# Altium schematic sheet USB_Connectors.SchDoc: Apalis Evaluation Board 1.1
size A3; Organization: Toradex AG; Address1: Altsagenstrasse 5; Address2: Horw; Address3: 6048; Address4: Switzerland; DocumentNumber: 7; Revision: V1.1; SheetNumber: 7; SheetTotal: 32; PageSetup: Record=PageOptions|CenterHorizontal=True|CenterVertical=True|PrintScale=0.71|XCorrection=1.00|YCorrection=1.00|PrintKind=0|BorderSize=5000000|LeftOffset=0|BottomOffset=0|Orientation=2|PaperLength=1000|PaperWidth=1000|Scale=100|PaperSource=7|PrintQuality=-4|MediaType=1|DitherType=10|PaperKind=A4|PrintScaleMode=1
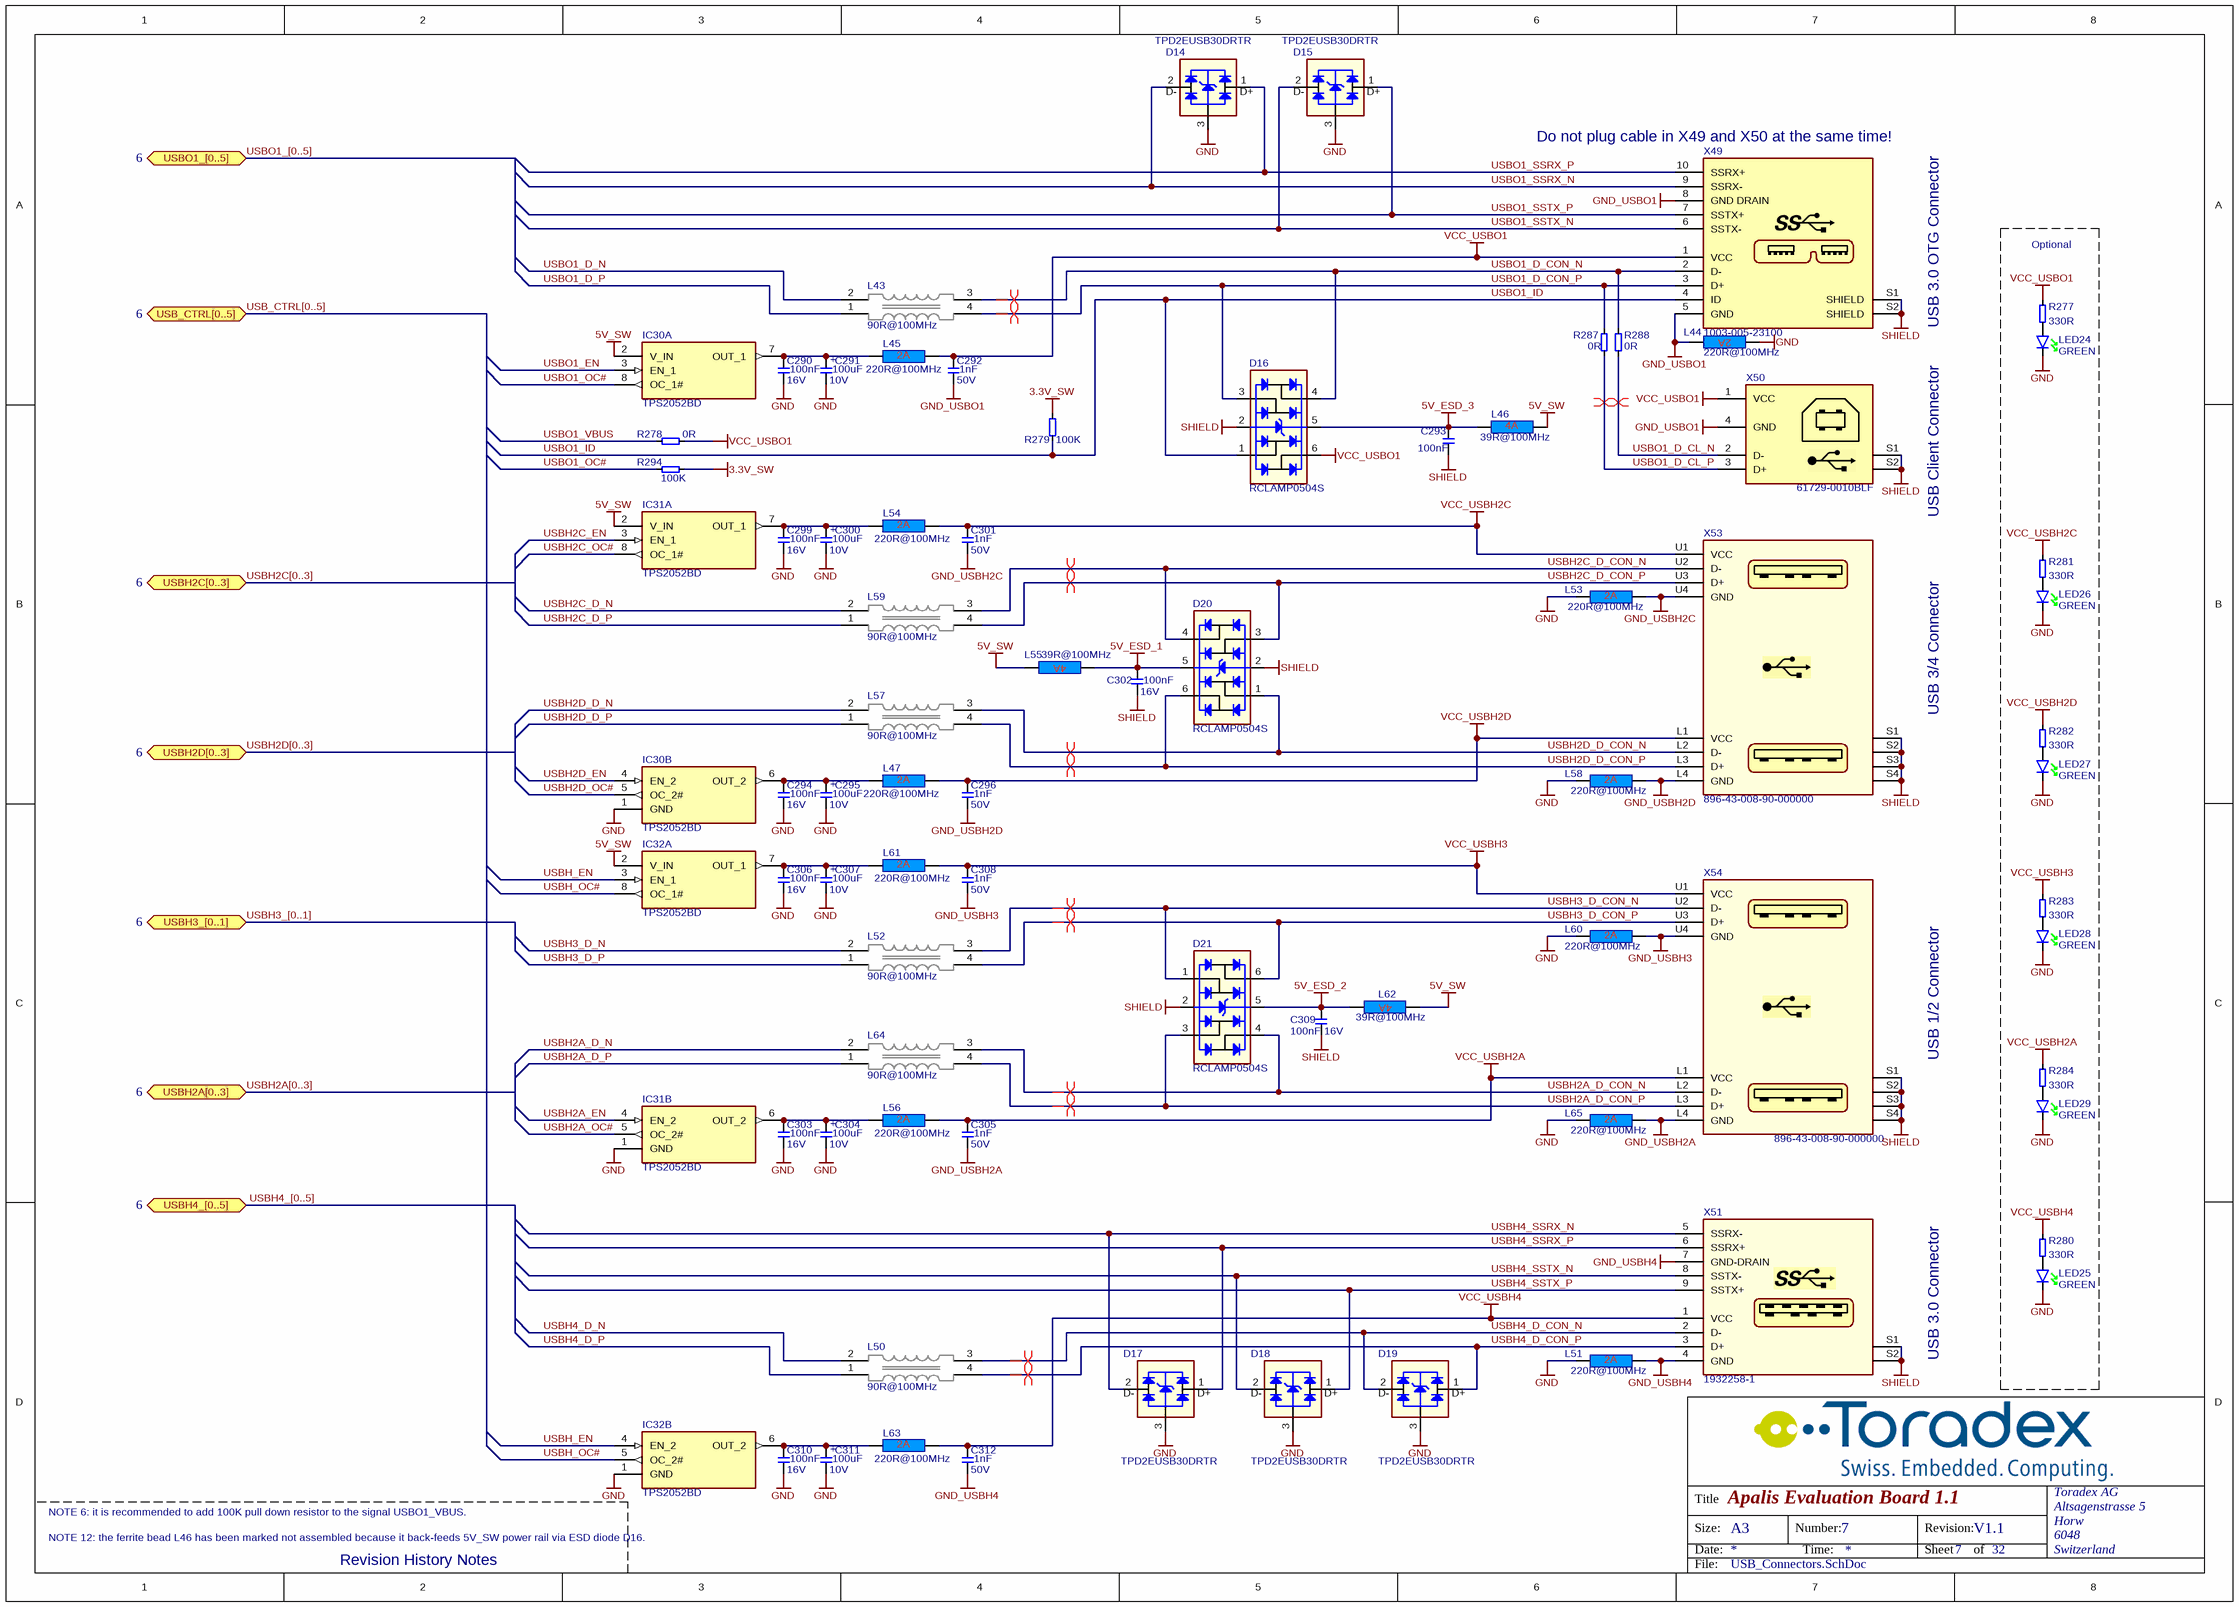
[diagram p0: USB_Connectors.SchDoc]

## Parts
C290  Rating: 16V  [T_CAPC0603X33N]  (hidden comment: 100nF)
C291  Rating: 10V  [CAPMP6032X280N]  (hidden comment: 100uF)
C292  Rating: 50V  [T_CAPC0603X33N]  (hidden comment: 1nF)
C293  100nF  [T_CAPC0603X33N]
C294  Rating: 16V  [T_CAPC0603X33N]  (hidden comment: 100nF)
C295  Rating: 10V  [CAPMP6032X280N]  (hidden comment: 100uF)
C296  Rating: 50V  [T_CAPC0603X33N]  (hidden comment: 1nF)
C299  Rating: 16V  [T_CAPC0603X33N]  (hidden comment: 100nF)
C300  Rating: 10V  [CAPMP6032X280N]  (hidden comment: 100uF)
C301  Rating: 50V  [T_CAPC0603X33N]  (hidden comment: 1nF)
C302  Rating: 16V  [T_CAPC0603X33N]  (hidden comment: 100nF)
C303  Rating: 16V  [T_CAPC0603X33N]  (hidden comment: 100nF)
C304  Rating: 10V  [CAPMP6032X280N]  (hidden comment: 100uF)
C305  Rating: 50V  [T_CAPC0603X33N]  (hidden comment: 1nF)
C306  Rating: 16V  [T_CAPC0603X33N]  (hidden comment: 100nF)
C307  Rating: 10V  [CAPMP6032X280N]  (hidden comment: 100uF)
C308  Rating: 50V  [T_CAPC0603X33N]  (hidden comment: 1nF)
C309  Rating: 16V  [T_CAPC0603X33N]  (hidden comment: 100nF)
C310  Rating: 16V  [T_CAPC0603X33N]  (hidden comment: 100nF)
C311  Rating: 10V  [CAPMP6032X280N]  (hidden comment: 100uF)
C312  Rating: 50V  [T_CAPC0603X33N]  (hidden comment: 1nF)
D14  TPD2EUSB30DRTR  [T_TI_TPD2EUSB30DRTR]
D15  TPD2EUSB30DRTR  [T_TI_TPD2EUSB30DRTR]
D16  RCLAMP0504S  [T_SOT95P285X90-6N]
D17  TPD2EUSB30DRTR  [T_TI_TPD2EUSB30DRTR]
D18  TPD2EUSB30DRTR  [T_TI_TPD2EUSB30DRTR]
D19  TPD2EUSB30DRTR  [T_TI_TPD2EUSB30DRTR]
D20  RCLAMP0504S  [T_SOT95P285X90-6N]
D21  RCLAMP0504S  [T_SOT95P285X90-6N]
IC30  TPS2052BD  [SOIC127P600X173-8N]  (parts A,B of 2)
IC31  TPS2052BD  [SOIC127P600X173-8N]  (parts A,B of 2)
IC32  TPS2052BD  [SOIC127P600X173-8N]  (parts A,B of 2)
L43  90R@100MHz  [T_Murata_DLW21SN900SQ2]
L44  220R@100MHz  [INDC1608X95N]
L45  220R@100MHz  [INDC1608X95N]
L46  39R@100MHz  [INDC2013X130N]
L47  220R@100MHz  [INDC1608X95N]
L50  90R@100MHz  [T_Murata_DLW21SN900SQ2]
L51  220R@100MHz  [INDC1608X95N]
L52  90R@100MHz  [T_Murata_DLW21SN900SQ2]
L53  220R@100MHz  [INDC1608X95N]
L54  220R@100MHz  [INDC1608X95N]
L55  39R@100MHz  [INDC2013X130N]
L56  220R@100MHz  [INDC1608X95N]
L57  90R@100MHz  [T_Murata_DLW21SN900SQ2]
L58  220R@100MHz  [INDC1608X95N]
L59  90R@100MHz  [T_Murata_DLW21SN900SQ2]
L60  220R@100MHz  [INDC1608X95N]
L61  220R@100MHz  [INDC1608X95N]
L62  39R@100MHz  [INDC2013X130N]
L63  220R@100MHz  [INDC1608X95N]
L64  90R@100MHz  [T_Murata_DLW21SN900SQ2]
L65  220R@100MHz  [INDC1608X95N]
LED24  Color: GREEN  [T_Osram_T670_GREEN]  (hidden comment: LG T670-K1L2-1)
LED25  Color: GREEN  [T_Osram_T670_GREEN]  (hidden comment: LG T670-K1L2-1)
LED26  Color: GREEN  [T_Osram_T670_GREEN]  (hidden comment: LG T670-K1L2-1)
LED27  Color: GREEN  [T_Osram_T670_GREEN]  (hidden comment: LG T670-K1L2-1)
LED28  Color: GREEN  [T_Osram_T670_GREEN]  (hidden comment: LG T670-K1L2-1)
LED29  Color: GREEN  [T_Osram_T670_GREEN]  (hidden comment: LG T670-K1L2-1)
R277  330R  [T_RESC0603X30N]
R278  0R  [T_RESC0603X30N]
R279  100K  [t_RESC0603X30N]
R280  330R  [T_RESC0603X30N]
R281  330R  [T_RESC0603X30N]
R282  330R  [T_RESC0603X30N]
R283  330R  [T_RESC0603X30N]
R284  330R  [T_RESC0603X30N]
R287  0R  [RESC1005X40N]
R288  0R  [RESC1005X40N]
R294  100K  [t_RESC0603X30N]
X49  1003-005-23100  [T_Cnc_1003-005-23100]
X50  61729-0010BLF  [T_FCI_61729-0010BLF]
X51  1932258-1  [T_TE_1932258-1]
X53  896-43-008-90-000000  [T_MMMC_896-43-008-90-000000]
X54  896-43-008-90-000000  [T_MMMC_896-43-008-90-000000]

## Blocks framed on the sheet
Optional: LED24-LED29 R277 R280-R284

## Ports
USB_CTRL[0..5] (bidir, see 6), USBH2A[0..3] (bidir, see 6), USBH2C[0..3] (bidir, see 6), USBH2D[0..3] (bidir, see 6), USBH3_[0..1] (bidir, see 6), USBH4_[0..5] (bidir, see 6), USBO1_[0..5] (bidir, see 6)

## Nets
3.3V_SW: R279.1 R294.2
5V_ESD_1: C302.2 D20.5 L55.1
5V_ESD_2: C309.2 D21.5 L62.2
5V_ESD_3: C293.2 D16.5 L46.1
5V_SW: IC30.2(V_IN) IC31.2(V_IN) IC32.2(V_IN) L46.2 L55.2 L62.1
GND: C290.1 C291.2 C294.1 C295.2 C299.1 C300.2 C303.1 C304.2 C306.1 C307.2 C310.1 C311.2 D14.3 D15.3 D17.3 D18.3 D19.3 IC30.1(GND) IC31.1(GND) IC32.1(GND) L44.1 L51.1 L53.1 L58.1 L60.1 L65.1 LED24.K LED25.K LED26.K LED27.K LED28.K LED29.K
GND_USBH2A: C305.1 L65.2 X54.L4(GND)
GND_USBH2C: C301.1 L53.2 X53.U4(GND)
GND_USBH2D: C296.1 L58.2 X53.L4(GND)
GND_USBH3: C308.1 L60.2 X54.U4(GND)
GND_USBH4: C312.1 L51.2 X51.4(GND) X51.7(GND-DRAIN)
GND_USBO1: C292.1 L44.2 X49.5(GND) X49.8(GND_DRAIN) X50.4(GND)
SHIELD: C293.1 C302.1 C309.1 D16.2 D20.2 D21.2 X49.S1(SHIELD) X49.S2(SHIELD) X50.S1 X50.S2 X51.S1(SHIELD) X51.S2(SHIELD) X53.S1(SHIELD) X53.S2(SHIELD) X53.S3(SHIELD) X53.S4(SHIELD) X54.S1(SHIELD) X54.S2(SHIELD) X54.S3(SHIELD) X54.S4(SHIELD)
VCC_USBH2A: C305.2 L56.2 R284.2 X54.L1(VCC)
VCC_USBH2C: C301.2 L54.2 R281.2 X53.U1(VCC)
VCC_USBH2D: C296.2 L47.2 R282.2 X53.L1(VCC)
VCC_USBH3: C308.2 L61.2 R283.2 X54.U1(VCC)
VCC_USBH4: C312.2 L63.2 R280.2 X51.1(VCC)
VCC_USBO1: C292.2 D16.6 L45.2 R277.2 R278.2 X49.1(VCC) X50.1(VCC)
USBH2A_D_CON_N: D21.4 L64.3 X54.L2(D-)
USBH2A_D_CON_P: D21.3 L64.4 X54.L3(D+)
USBH2A_D_N: L64.2
USBH2A_D_P: L64.1
USBH2A_EN: IC31.4(EN_2)
USBH2A_OC#: IC31.5(OC_2#)
USBH2C_D_CON_N: D20.4 L59.3 X53.U2(D-)
USBH2C_D_CON_P: D20.3 L59.4 X53.U3(D+)
USBH2C_D_N: L59.2
USBH2C_D_P: L59.1
USBH2C_EN: IC31.3(EN_1)
USBH2C_OC#: IC31.8(OC_1#)
USBH2D_D_CON_N: D20.1 L57.3 X53.L2(D-)
USBH2D_D_CON_P: D20.6 L57.4 X53.L3(D+)
USBH2D_D_N: L57.2
USBH2D_D_P: L57.1
USBH2D_EN: IC30.4(EN_2)
USBH2D_OC#: IC30.5(OC_2#)
USBH3_D_CON_N: D21.1 L52.3 X54.U2(D-)
USBH3_D_CON_P: D21.6 L52.4 X54.U3(D+)
USBH3_D_N: L52.2
USBH3_D_P: L52.1
USBH4_D_CON_N: D19.2(D-) L50.3 X51.2(D-)
USBH4_D_CON_P: D19.1(D+) L50.4 X51.3(D+)
USBH4_D_N: L50.2
USBH4_D_P: L50.1
USBH4_SSRX_N: D17.2(D-) X51.5(SSRX-)
USBH4_SSRX_P: D17.1(D+) X51.6(SSRX+)
USBH4_SSTX_N: D18.2(D-) X51.8(SSTX-)
USBH4_SSTX_P: D18.1(D+) X51.9(SSTX+)
USBH_EN: IC32.3(EN_1) IC32.4(EN_2)
USBH_OC#: IC32.5(OC_2#) IC32.8(OC_1#)
USBO1_D_CL_N: R288.1 X50.2(D-)
USBO1_D_CL_P: R287.1 X50.3(D+)
USBO1_D_CON_N: D16.4 L43.3 R288.2 X49.2(D-)
USBO1_D_CON_P: D16.3 L43.4 R287.2 X49.3(D+)
USBO1_D_N: L43.2
USBO1_D_P: L43.1
USBO1_EN: IC30.3(EN_1)
USBO1_ID: D16.1 R279.2 X49.4(ID)
USBO1_OC#: IC30.8(OC_1#) R294.1
USBO1_SSRX_N: D14.2(D-) X49.9(SSRX-)
USBO1_SSRX_P: D14.1(D+) X49.10(SSRX+)
USBO1_SSTX_N: D15.2(D-) X49.6(SSTX-)
USBO1_SSTX_P: D15.1(D+) X49.7(SSTX+)
USBO1_VBUS: R278.1
NetC290_2: C290.2 C291.1 IC30.7(OUT_1) L45.1
NetC294_2: C294.2 C295.1 IC30.6(OUT_2) L47.1
NetC299_2: C299.2 C300.1 IC31.7(OUT_1) L54.1
NetC303_2: C303.2 C304.1 IC31.6(OUT_2) L56.1
NetC306_2: C306.2 C307.1 IC32.7(OUT_1) L61.1
NetC310_2: C310.2 C311.1 IC32.6(OUT_2) L63.1
NetLED24_A: LED24.A R277.1
NetLED25_A: LED25.A R280.1
NetLED26_A: LED26.A R281.1
NetLED27_A: LED27.A R282.1
NetLED28_A: LED28.A R283.1
NetLED29_A: LED29.A R284.1

## Buses and harness runs
bus USB_CTRL[0..5] = port USB_CTRL[0..5]
bus USBH2A[0..3] = port USBH2A[0..3]
bus USBH2C[0..3] = port USBH2C[0..3]
bus USBH2D[0..3] = port USBH2D[0..3]
bus USBH3_[0..1] = port USBH3_[0..1]
bus USBH4_[0..5] = port USBH4_[0..5]
bus USBO1_[0..5] = port USBO1_[0..5]

## Layout directives
differential pair: USBH2A_D_CON_N, USBH2A_D_CON_P, USBH2C_D_CON_N, USBH2C_D_CON_P, USBH2D_D_CON_N, USBH2D_D_CON_P, USBH3_D_CON_N, USBH3_D_CON_P, USBH4_D_CON_N, USBH4_D_CON_P, USBO1_D_CL_N, USBO1_D_CL_P, USBO1_D_CON_N, USBO1_D_CON_P

## Notes on the sheet
- (near X49) Do not plug cable in X49 and X50 at the same time!
- (near X49) USB 3.0 OTG Connector
- USB Client Connector
- (near X53) USB 3/4 Connector
- (near X54) USB 1/2 Connector
- (near X51) USB 3.0 Connector
- NOTE 6: it is recommended to add 100K pull down resistor to the signal USBO1_VBUS.
- NOTE 12: the ferrite bead L46 has been marked not assembled because it back-feeds 5V_SW power rail via ESD diode D16.
- Revision History Notes
- Title
- Size:
- Date:
- A3
- Number:
- Time:
- Revision:
- Sheet
- of
- File:
- (in symbol C-TA-100uF-10V-10%-6032) +

## Library data of the parts
C290 C293 C294 C299 C302 C303 C306 C309 C310 = C-X7R-100nF-16V-10%-0603: Capacitor Ceramic X7R 100nF 16V 10% 0603; Tolerance: 10%; Type: X7R; Value: 100nF
C291 C295 C300 C304 C307 C311 = C-TA-100uF-10V-10%-6032: Capacitor TA 100uF 10V 10% 6032; Tolerance: 10%; Type: TA; Value: 100uF
C292 C296 C301 C305 C308 C312 = C-X7R-1nF-50V-10%-0603: Capacitor Ceramic X7R 1nF 50V 10% 0603; Tolerance: 10%; Type: X7R; Value: 1nF
D14 D15 D17-D19 = D-TI-TPD2EUSB30DRTR: 2 Channel Protection for Super Speed USB3.0; Manufacturer Name: TI; Manufacturer Part No.: TPD2EUSB30DRTR
D16 D20 D21 = D-Semtech-RClamp0504S: TVS Array low cap; Manufacturer Name: Semtech; Manufacturer Part No.: RCLAMP0504S
IC30-IC32 = IC-TI-TPS2052BD: Dual High Side Switch With OC_DET 500mA/CH; Manufacturer Name: Texas Instruments; Manufacturer Part No.: TPS2052BD
L43 L50 L52 L57 L59 L64 = L-Murata-DLW21SN900SQ2-90R@100MHz-330mA-25%: Common Mode Choke High Speed 90R 330mA; Manufacturer Name: Murata; Tolerance: 25%; Rating: 330mA; Manufacturer Part No.: DLW21SN900SQ2; Value: 90R@100MHz
L44 L45 L47 L51 L53 L54 L56 L58 L60 L61 L63 L65 = L-220R@100MHz-2A-25%-0603: 220R@100MHz 2A EMI FILTER; Tolerance: 25%; Rating: 2A; Value: 220R@100MHz
L46 L55 L62 = L-Panasonic-EXC-ML20A390U-39R@100MHz-4A-25%-0805: 39R@100MHz 4A EMI FILTER; Tolerance: 25%; Rating: 4A; Manufacturer Name: Panasonic; Manufacturer Name: EXC-ML20A390U; Value: 39R@100MHz
LED24-LED29 = LED-Osram-T670-K1L2-1: LED green Osram LG T670-K1L2-1; Manufacturer Name: Osram; Manufacturer Part No.: LG T670-K1L2-1
R277 R280-R284 = R-330R-63mW-5%-0603: Resistor 330 ohm 63mW 5% 0603; Rating: 63mW; Tolerance: 5%; Value: 330R
R278 = R-0R-63mW-1%-0603: Resistor 0 ohm 63mW 1% 0603; Rating: 63mW; Tolerance: 1%; Value: 0R
R279 R294 = R-100KR-63mW-5%-0603: Resistor 100 Kohm 63mW 5% 0603; Value: 100KR; Rating: 63mW; Tolerance: 5%
R287 R288 = R-0R-63mW-1%-0402: Resistor 0 ohm 63mW 1% 0402; Rating: 63mW; Tolerance: 1%; Value: 0R
X49 = CON-CnC-1003-005-23100: Micro USB AB 3.0 Connector; Manufacturer Name: CnC Tech.; No. of ways: 10; Manufacturer Part No.: 1003-005-23100
X50 = CON-FCI-61729-0010BLF: USB Type B Connector; Manufacturer Name: FCI; No. of ways: 4; Manufacturer Part No.: 61729-0010BLF
X51 = CON-TECon-1932258-1: USB 3.0, Type A; Manufacturer Name: TE Connectivity; No. of ways: 9; Manufacturer Part No.: 1932258-1
X53 X54 = CON-MMMC-896-43-008-90-000000: USB 2.0 double row, Type A; Manufacturer Name: Mill-Max Mfg. Corp.; No. of ways: 8; Manufacturer Part No.: 896-43-008-90-000000